# Altium schematic sheet LD3320.SchDoc
size A3
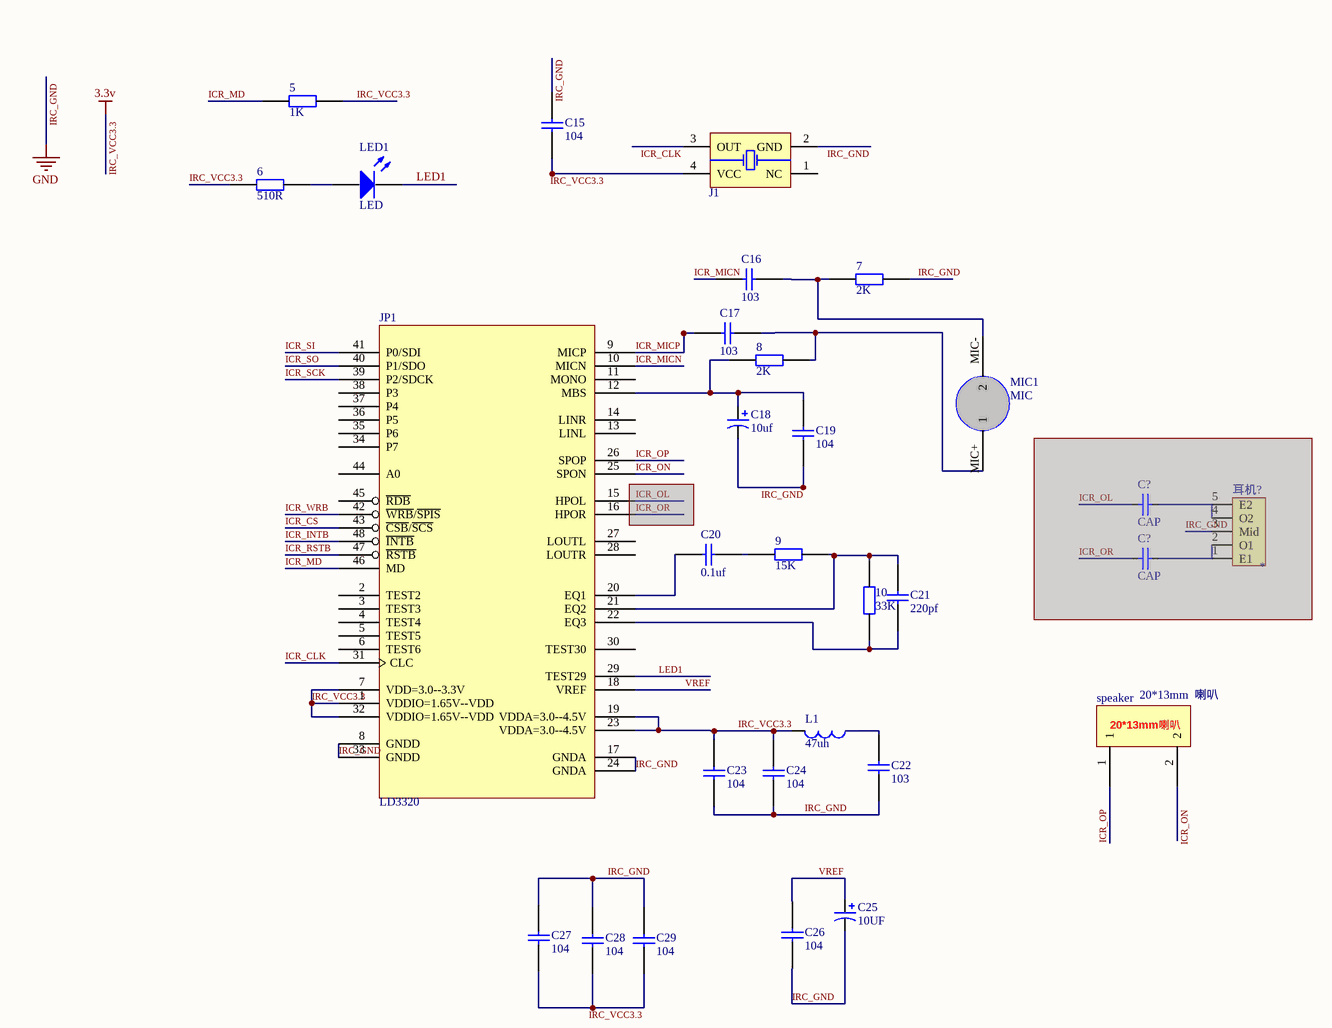
[diagram p0: LD3320.SchDoc]

## Parts
(Parts that share a designator on the sheet are numbered #1, #2 ... from top to bottom, then left to right.)
5  阻值: 1K  [0603]  (hidden comment: 电阻0603)
6  阻值: 510R  [0603]  (hidden comment: 电阻0603)
7  阻值: 2K  [0603]  (hidden comment: 电阻0603)
8  阻值: 2K  [0603]  (hidden comment: 电阻0603)
9  阻值: 15K  [0603]  (hidden comment: 电阻0603)
10  阻值: 33K  [0603]  (hidden comment: 电阻0603)
C15  104  [0603]
C16  103  [0603]
C17  103  [0603]
C18  10uf  [1206]
C19  104  [0603]
C20  0.1uf  [0603]
C21  220pf  [0603]
C22  103  [0603]
C23  104  [0603]
C24  104  [0603]
C25  10UF  [1206]
C26  104  [0603]
C27  104  [0603]
C28  104  [0603]
C29  104  [0603]
C?#1  CAP  [0805C]  (masked out: inside a compile mask, not in the netlist)
C?#2  CAP  [0805C]  (masked out: inside a compile mask, not in the netlist)
J1  oscillator  [J有源晶振-正方]  (value not drawn)
JP1  LD3320  [QFN48]
L1  47uh  [0805]
LED1  LED  [0603]
MIC1  MIC  [MIC]
speaker  20*13mm  喇叭  [20*13mm 喇叭]
耳机?  *  [耳机]  (masked out: inside a compile mask, not in the netlist)

## Nets
IRC_GND: 7.1 C15.1 C18.2 C19.2 C22.2 C23.2 C24.2 C25.2 C26.2 C27.1 C28.1 C29.1 J1.2(GND) JP1.8(GNDD) JP1.17(GNDA) JP1.24(GNDA) JP1.33(GNDD)  [also labelled GND]
IRC_VCC3.3: 5.1 6.2 C15.2 C23.1 C24.1 C27.2 C28.2 C29.2 J1.4(VCC) JP1.1(VDDIO=1.65V--VDD) JP1.7(VDD=3.0--3.3V) JP1.19(VDDA=3.0--4.5V) JP1.23(VDDA=3.0--4.5V) JP1.32(VDDIO=1.65V--VDD) L1.1  [also labelled 3.3v]
ICR_CLK: J1.3(OUT) JP1.31(CLC)
ICR_CS: JP1.43(~{CSB}/~{SCS})
ICR_INTB: JP1.48(~{INTB})
ICR_MD: 5.2 JP1.46(MD)
ICR_MICN: C16.2 JP1.10(MICN)
ICR_MICP: C17.2 JP1.9(MICP)
ICR_ON: JP1.25(SPON) speaker.2
ICR_OP: JP1.26(SPOP) speaker.1
ICR_RSTB: JP1.47(~{RSTB})
ICR_SCK: JP1.39(P2/SDCK)
ICR_SI: JP1.41(P0/SDI)
ICR_SO: JP1.40(P1/SDO)
ICR_WRB: JP1.42(~{WRB}/~{SPIS})
LED1: JP1.29(TEST29) LED1.2
VREF: C25.1 C26.1 JP1.18(VREF)
Net6_1: 6.1 LED1.1
Net7_2: 7.2 C16.1 MIC1.MIC-(2)
Net8_1: 8.1 C17.1 MIC1.MIC+(1)
Net8_2: 8.2 C18.1 C19.1 JP1.12(MBS)
Net9_1: 9.1 10.1 C21.1 JP1.21(EQ2)
Net9_2: 9.2 C20.1
Net10_2: 10.2 C21.2 JP1.22(EQ3)
NetC20_2: C20.2 JP1.20(EQ1)
NetC22_1: C22.1 L1.2

Not connected (* = marked no-connect by the designer): J1 1(NC); JP1 2(TEST2) 3(TEST3) 4(TEST4) 5(TEST5) 6(TEST6) 11(MONO) 13(LINL) 14(LINR) 15(HPOL) 16(HPOR) 27(LOUTL) 28(LOUTR) 30(TEST30) 34(P7) 35(P6) 36(P5) 37(P4) 38(P3) 44(A0) 45(~{RDB})

## Notes on the sheet
- Labels drawn without touching a wire or pin: IRC_VCC3.3
- (in symbol 20*13mm  喇叭) 20*13mm喇叭

## Library data of the parts
C15-C17 C19-C24 C26-C29 = 电容0603
C18 C25 = Cap Pol2: 电解电容; Published: 8-Jun-2000; LatestRevisionDate: 17-Jul-2002; LatestRevisionNote: Re-released for DXP Platform.; PackageReference: POLAR0.8; Publisher: Altium Limited
J1 = J晶振 有源
L1 = L
耳机? = 耳机接口: Comme: 耳机